# Altium schematic sheet arduino_motor.SchDoc
size A; SheetNumber: 1; SheetTotal: 1
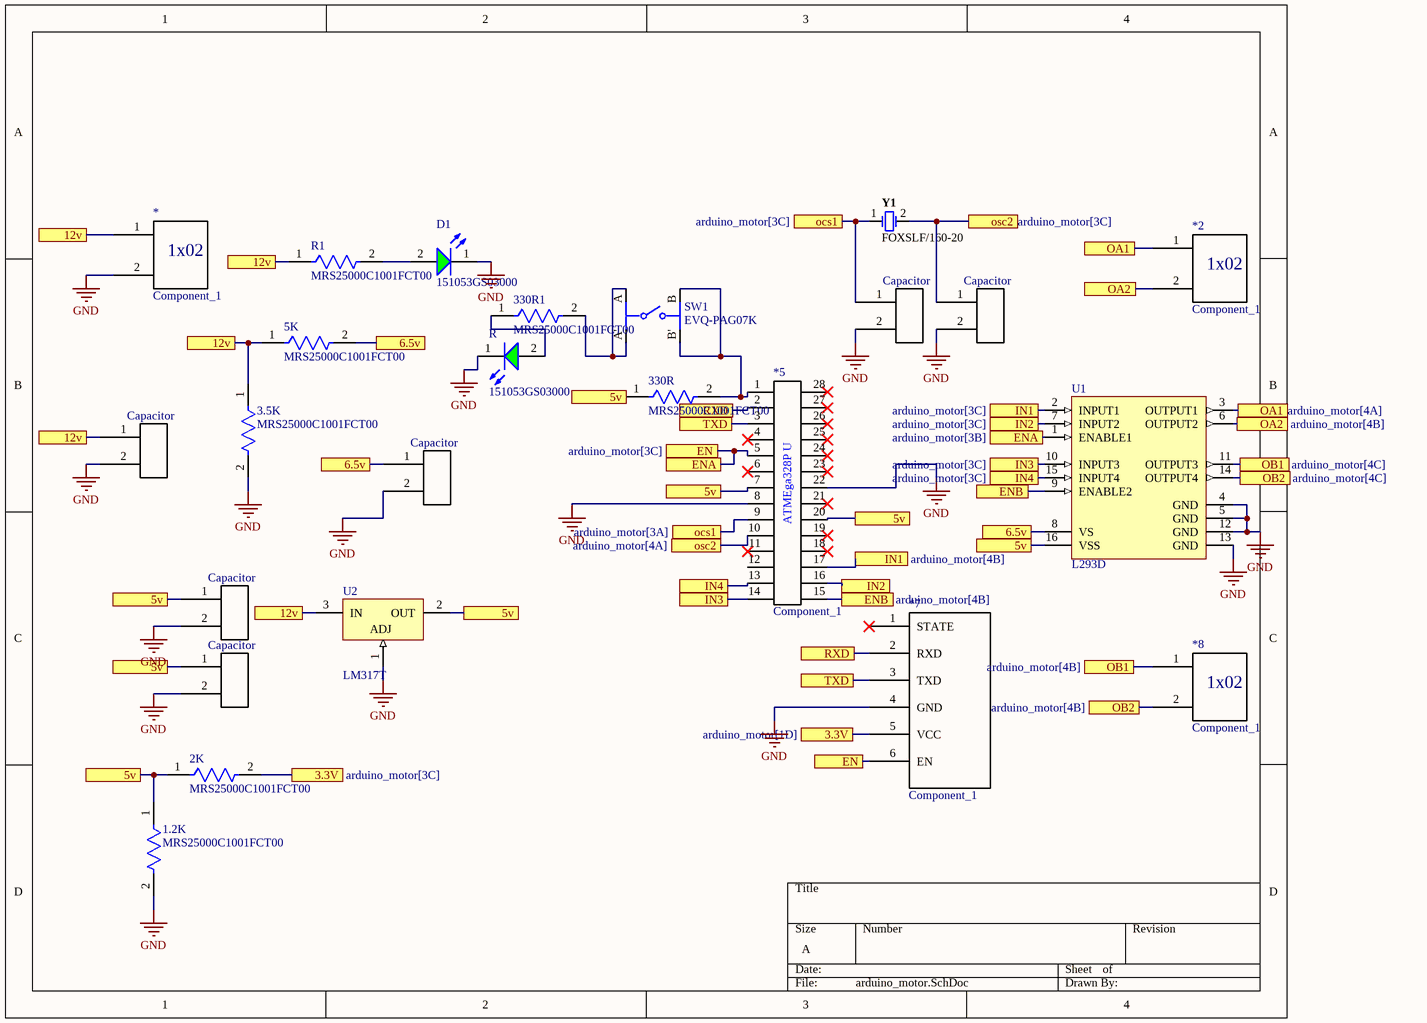
[diagram p0: arduino_motor.SchDoc]

## Parts
(Parts that share a designator on the sheet are numbered #1, #2 ... from top to bottom, then left to right.)
1.2K  MRS25000C1001FCT00  [FP-MRS25-MFG]
2K  MRS25000C1001FCT00  [FP-MRS25-MFG]
3.5K  MRS25000C1001FCT00  [FP-MRS25-MFG]
5K  MRS25000C1001FCT00  [FP-MRS25-MFG]
330R  MRS25000C1001FCT00  [FP-MRS25-MFG]
330R1  MRS25000C1001FCT00  [FP-MRS25-MFG]
*  Component_1  [PCBComponent_1]
*1  capacitor  [PCBComponent_1]  (value not drawn)
*2  Component_1  [PCBComponent_1]
*3  capacitor  [PCBComponent_1]  (value not drawn)
*4  capacitor  [PCBComponent_1]  (value not drawn)
*5  Component_1  [PCBComponent_1]
*6  capacitor  [PCBComponent_1]  (value not drawn)
*7  Component_1  [PCBComponent_1]
*8  Component_1  [PCBComponent_1]
*9  capacitor  [PCBComponent_1]  (value not drawn)
*10  capacitor  [PCBComponent_1]  (value not drawn)
D1  151053GS03000  [WL-TMRW_D5.8H11.7]
R1  MRS25000C1001FCT00  [FP-MRS25-MFG]
R#1  RES  [PCBComponent_1]  (value not drawn)  (parts A,B,C,D,E of 6)
R#2  151053GS03000  [WL-TMRW_D5.8H11.7]
SW1  EVQ-PAG07K  [FP-EVQ-PAG07K-MFG]
U1  L293D  [STM-L293D-16]
U2  LM317T  [NDE0003A]
Y1  FOXSLF/160-20  [FOX-FOXSLF160-20]

## Ports
3.3V (see arduino_motor[1D]), 3.3V (see arduino_motor[3C]), 5v (see arduino_motor[1C], arduino_motor[1D], arduino_motor[2B], arduino_motor[2C], arduino_motor[3B], arduino_motor[3C]), 5v (see arduino_motor[1C], arduino_motor[1D], arduino_motor[2B], arduino_motor[2C], arduino_motor[3B], arduino_motor[3C], arduino_motor[4C]), 5v (see arduino_motor[1C], arduino_motor[1D], arduino_motor[2B], arduino_motor[2C], arduino_motor[3B], arduino_motor[4C]), 5v (see arduino_motor[1C], arduino_motor[1D], arduino_motor[2B], arduino_motor[2C], arduino_motor[3C], arduino_motor[4C]), 5v (see arduino_motor[1C], arduino_motor[1D], arduino_motor[2B], arduino_motor[3B], arduino_motor[3C], arduino_motor[4C]), 5v (see arduino_motor[1C], arduino_motor[1D], arduino_motor[2C], arduino_motor[3B], arduino_motor[3C], arduino_motor[4C]), 5v (see arduino_motor[1C], arduino_motor[2B], arduino_motor[2C], arduino_motor[3B], arduino_motor[3C], arduino_motor[4C]), 6.5v (see arduino_motor[1B], arduino_motor[2B]), 6.5v (see arduino_motor[1B], arduino_motor[4C]), 6.5v (see arduino_motor[2B], arduino_motor[4C]), 12v (see arduino_motor[1A], arduino_motor[1B]), 12v (see arduino_motor[1A], arduino_motor[1B], arduino_motor[1C]), 12v (see arduino_motor[1B], arduino_motor[1C]), EN (see arduino_motor[3B]), EN (see arduino_motor[3C]), ENA (see arduino_motor[3B]), ENA (see arduino_motor[4B]), ENB (see arduino_motor[3C]), ENB (see arduino_motor[4B]), IN1 (see arduino_motor[3C]), IN1 (see arduino_motor[4B]), IN2 (see arduino_motor[3C]), IN2 (see arduino_motor[4B]), IN3 (see arduino_motor[3C]), IN3 (see arduino_motor[4B]), IN4 (see arduino_motor[3C]), IN4 (see arduino_motor[4B]), OA1 (see arduino_motor[4A]), OA1 (see arduino_motor[4B]), OA2 (see arduino_motor[4B]), OB1 (see arduino_motor[4B]), OB1 (see arduino_motor[4C]), OB2 (see arduino_motor[4B]), OB2 (see arduino_motor[4C]), ocs1 (see arduino_motor[3A]), ocs1 (see arduino_motor[3C]), osc2 (see arduino_motor[3C]), osc2 (see arduino_motor[4A]), RXD (see arduino_motor[3B]), RXD (see arduino_motor[3C]), TXD (see arduino_motor[3B]), TXD (see arduino_motor[3C])

## Nets
GND: 1.2K.2 3.5K.2 *.2 *1.2 *3.2 *4.2 *5.8 *5.22 *6.2 *7.4(GND) *9.2 *10.2 D1.1(K) R#2.1(K) U1.4(GND) U1.5(GND) U1.12(GND) U1.13(GND) U2.1(ADJ)
3.3V: 2K.2 *7.5(VCC) ; port 3.3V
5v: 1.2K.1 2K.1 330R.1 *5.7 *5.20 *9.1 *10.1 U1.16(VSS) U2.2(OUT) ; port 5v
6.5v: 5K.2 *1.1 U1.8(VS) ; port 6.5v
12v: 3.5K.1 5K.1 *.1 *6.1 R1.1 U2.3(IN) ; port 12v
EN: *5.5 *7.6(EN) U1.1(ENABLE1) ; port ENA, port EN
ENB: *5.15 U1.9(ENABLE2) ; port ENB
IN1: *5.17 U1.2(INPUT1) ; port IN1
IN2: *5.16 U1.7(INPUT2) ; port IN2
IN3: *5.14 U1.10(INPUT3) ; port IN3
IN4: *5.13 U1.15(INPUT4) ; port IN4
OA1: *2.1 U1.3(OUTPUT1) ; port OA1
OA2: *2.2 U1.6(OUTPUT2) ; port OA2
OB1: *8.1 U1.11(OUTPUT3) ; port OB1
OB2: *8.2 U1.14(OUTPUT4) ; port OB2
ocs1: *3.1 *5.9 Y1.1 ; port ocs1
osc2: *4.1 *5.10 Y1.2 ; port osc2
RXD: *5.2 *7.2(RXD) ; port RXD
TXD: *5.3 *7.3(TXD) ; port TXD
Net330R1_1: 330R1.1 R#2.2(A)
Net330R1_2: 330R1.2 SW1.A SW1.A'
Net330R_2: 330R.2 *5.1 SW1.B SW1.B'
NetD1_2: D1.2(A) R1.2

Not connected (* = marked no-connect by the designer): *5 4* 6* 11* 12 18* 19* 21* 23* 24* 25* 26* 27* 28*; *7 1(STATE)*

## Notes on the sheet
- (in symbol capacitor) Capacitor
- (in symbol Component_1) ATMEga328P U; 1x02

## Library data of the parts
1.2K 2K 3.5K 5K 330R 330R1 R1 = CMP-02408-000051-1: RES 1K OHM 0.6W 1% AXIAL; Power Rating: 600mW; Lead Diameter: 0.6mm; Voltage Rating (DC): 350V; Resistance: 1kR; Temperature Coefficient: 50ppm/°C; Width: 2.5mm; Military Standard: Not; Package Quantity: 5000; Radiation Hardening: No; Case/Package: Axial; Resistance Tolerance: 1%; Resistor Type: Metal Film; Contact Plating: Tin; Length: 6.5mm; Lead Free: Lead Free; RoHS Compliant: Yes; Mount: Through Hole; Number of Pins: 2; Technology: THIN FILM; Voltage Rating: 350V; Min Operating Temperature: -55°C; Weight: 0.00776oz; Diameter: 2.5mm; Construction: Cylindrical; Series: MRS25; Tolerance: 1%; Packaging: Tape and Reel; Max Operating Temperature: 155°C; Max Power Dissipation: 600mW; Number of Terminations: 2; Termination: Axial
D1 = CMP-1489-00005-2: NexarPartId: 29717817; Viewing Angle: 30°; Color: Green; Wavelength: 522nm; Max Reverse Voltage (DC): 5V; Test Current: 20mA; Forward Current: 100mA; Forward Voltage: 3.4V; Lens Style: Circular, Clear, Round; Luminous Intensity: 10cd; Lens Size: 5mm; Peak Wavelength: 515nm; Length: 5mm; Min Operating Temperature: -40°C; Case/Package: Radial; REACH SVHC: Unknown; Height: 8.6mm; Mount: Through Hole; Dominant Wavelength: 522nm; Max Operating Temperature: 85°C; Width: 5mm; Packaging: Bulk; RoHS: Compliant
R#2 = CMP-1489-00005-2: NexarPartId: 29717817; Viewing Angle: 30°; Wavelength: 522nm; Max Reverse Voltage (DC): 5V; Test Current: 20mA; Forward Current: 100mA; Forward Voltage: 3.4V; Lens Style: Circular, Clear, Round; Luminous Intensity: 10cd; Lens Size: 5mm; Peak Wavelength: 515nm; Length: 5mm; Min Operating Temperature: -40°C; Color: Green; Case/Package: Radial; REACH SVHC: Unknown; Height: 8.6mm; Mount: Through Hole; Dominant Wavelength: 522nm; Max Operating Temperature: 85°C; Width: 5mm; Packaging: Bulk; RoHS: Compliant
SW1 = CMP-05618-000034-1: SWITCH TACTILE SPST-NO 0.02A 15V; Contact Current Rating: 20mA; Switch Function: Off-Mom; Illumination Type: Non-Illuminated; Switch Travel: 0.25mm; Operating Force: 2.6N; Actuator Color: Black; Actuator Length: 3.1mm; Contact Resistance: 50mR; Throw Configuration: SPST; Electrical Life: 50000Cycles; Actuator Type: Standard; Mount: Through Hole; Package Quantity: 500; RoHS Compliant: Yes; Packaging: Bulk; Orientation: Straight; Current Rating: 20mA; Voltage Rating (DC): 15V; Series: EVQPA; Length: 6mm; Termination: PC Pin; Max Current Rating: 20mA; Min Operating Temperature: -20°C; Size: 6mm; Depth: 7.8mm; Max Operating Temperature: 70°C; Mechanical Life: 50000Cycles; Lead Free: Lead Free; Max Voltage Rating (DC): 15V; Radiation Hardening: No
U1 = CMP-2000-06524-1: Push-Pull Four Channel Driver with Diode, 4.5 to 36 V, -40 to 150 degC, 16-Pin PDIP, RoHS, Tube; Manufacturer: STMicroelectronics; Number of Outputs: 4; Current - Peak Output: 1.2A; Current - Output / Channel: 600mA; Input Type: Non-Inverting; Other Related Documents: L293DViewAllSpecifications; Dynamic Catalog: HalfBridge; Voltage - Supply: 4.5V~36V; Other Names: 497-2936-5; Package / Case: 16-DIP(0.300",7.62mm); PartNumber: L293D; Operating Temperature: -40°C~150°C; Datasheet URL: http://www.st.com/st-web-ui/static/active/en/resource/technical/document/datasheet/CD00000059.pdf; Supplier Device Package: 16-PowerDIP; Packaging: Tube; Package Description: 16-Pin Thru-Hole Dual-In-Line, Body 20 x 6.85 mm, Pitch 2.54 mm; Standard Package: 25; Datasheet Version: 07/2003; On-State Resistance: -; Manufacturer URL: http://www.st.com/; Category: IntegratedCircuits(ICs); Family: PMIC-MOSFET,BridgeDrivers-InternalSwitch; Type: HalfBridge; Series: -; Mounting Technology: ThroughHole; Package Reference: DIP-16; Mounting Type: ThroughHole
U2 = CMP-0062-02456-3: 3-Terminal Adjustable Regulator, 3-pin TO-220; Manufacturer: Texas Instruments; CompType: LDO IC; PowerWise: N; PackageTopMarking: NSUZXYTTE#*LM317T P+; ComponentLink1Description: Datasheet URL; PackageReference: NDE0003A; PinCount: 3; ComponentLink1URL: http://www.ti.com/general/docs/lit/getliterature.tsp?genericPartNumber=LM317-N&fileType=pdf; RoHS: N; PackageDescription: TO-220, Molded, 3 Lead, Straight
Y1 = CMP-1749-00003-1: Resistance Weld Thru-Hole Crystal, 16 MHz, -20 to 70 degC, 2-Pin THD, RoHS, Bulk; Voltage Rating: 250 V; Tolerance: 1%; Resistance: 221 kohm; Case\Package: Axial; Power Rating: 250 mW; RoHSCompliant: true; Package Quantity: 200; Packaging: Bulk; Min Operating Temperature: -55 degC; DatasheetVersion: Mar-15; ComponentLink1URL: http://www.foxonline.com/; Max Operating Temperature: 155 degC; PackageReference: FOXSLF160-20; Mount: Through Hole; PackageDescription: 2-Pin Through Hole Device, Body 11.35 x 4.65 mm; ComponentLink1Description: Manufacturer URL; ComponentLink2URL: http://www.foxonline.com/pdfs/hc49slf.pdf; ComponentLink2Description: Datasheet; Length: 0.248 inch